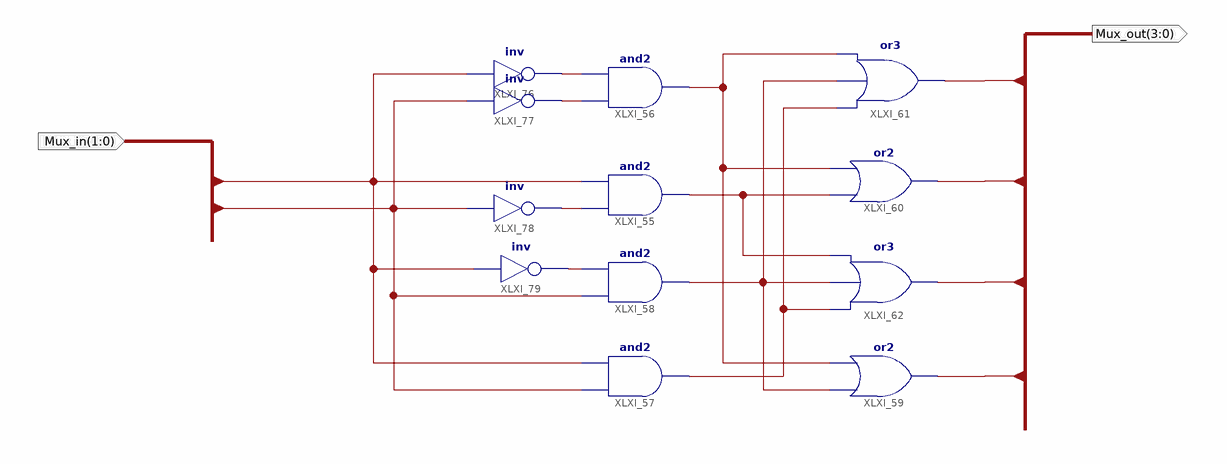
[diagram p0: schematic sheet 1]
// Xilinx ISE schematic EX1_MUX.sch (spartan3e) as structural Verilog: 12 symbols, 2 ports
module EX1_MUX (
  input  [1:0] Mux_in,
  output [3:0] Mux_out
);

  wire XLXN_6, XLXN_7, XLXN_8, XLXN_9, XLXN_10, XLXN_14, XLXN_16, XLXN_22;

  and XLXI_56 (XLXN_10, XLXN_6, XLXN_7);
  and XLXI_55 (XLXN_14, XLXN_8, Mux_in[0]);
  and XLXI_58 (XLXN_16, Mux_in[1], XLXN_9);
  and XLXI_57 (XLXN_22, Mux_in[1], Mux_in[0]);
  not XLXI_76 (XLXN_7, Mux_in[0]);
  not XLXI_77 (XLXN_6, Mux_in[1]);
  not XLXI_78 (XLXN_8, Mux_in[1]);
  not XLXI_79 (XLXN_9, Mux_in[0]);
  or XLXI_61 (Mux_out[0], XLXN_22, XLXN_16, XLXN_10);
  or XLXI_60 (Mux_out[1], XLXN_14, XLXN_10);
  or XLXI_62 (Mux_out[2], XLXN_22, XLXN_16, XLXN_14);
  or XLXI_59 (Mux_out[3], XLXN_16, XLXN_10);
endmodule
